# Altium schematic sheet ADR_LEDs.SchDoc
size A4; SheetNumber: 5; SheetTotal: 5
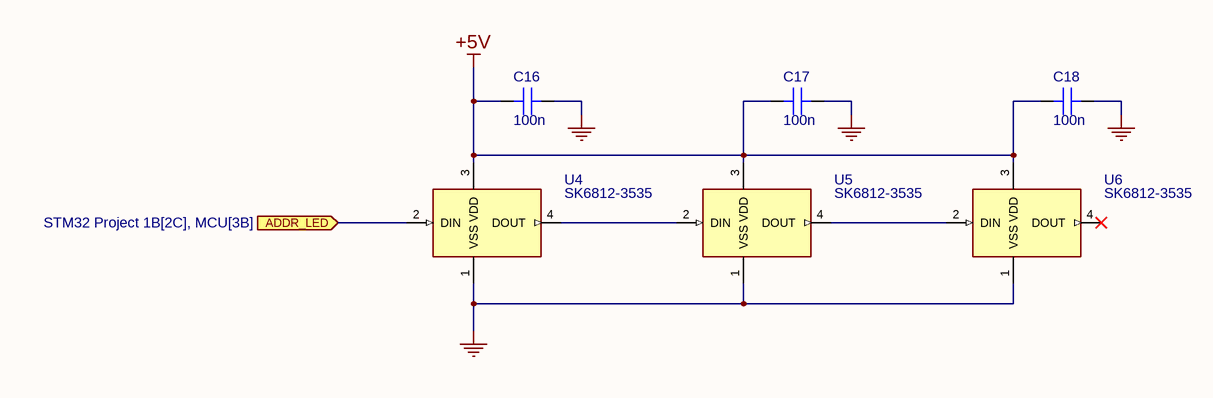
[diagram p0: ADR_LEDs.SchDoc]

## Parts
C16  100n  [CAP_0805]
C17  100n  [CAP_0805]
C18  100n  [CAP_0805]
U4  SK6812-3535  [SK6812-3535]
U5  SK6812-3535  [SK6812-3535]
U6  SK6812-3535  [SK6812-3535]

## Ports
ADDR_LED (in, see STM32 Project 1B[2C], MCU[3B])

## Nets
+5V: C16.2 C17.2 C18.2 U4.3(VDD) U5.3(VDD) U6.3(VDD)
GND: C16.1 C17.1 C18.1 U4.1(VSS) U5.1(VSS) U6.1(VSS)
ADDR_LED: U4.2(DIN) ; port ADDR_LED
NetU4_4: U4.4(DOUT) U5.2(DIN)
NetU5_4: U5.4(DOUT) U6.2(DIN)

Not connected (* = marked no-connect by the designer): U6 4(DOUT)*

## Library data of the parts
C16-C18 = CAP_0805: Capacitor SMD 0805 Generic; Manufacturer: *; Manufacturer Part Number: *; Tolerance: *; Voltage Rating: *; Dielectric: *
U4-U6 = SK6812-3535: NeoPixel 5050 RGB LED with Integrated Driver Chip - 10 Pack | Adafruit Industries 1655; Manufacturer Part Number: 1655; Number of LEDs: 10; Interface: Serial; Supplier: Digikey; Supplier Part Number: 1528-1104-ND; Manufacturer: Adafruit Industries; RoHS: Yes; Category: LEDs; Stock: 1730; Pricing: 1=4.5 (USD); Mounting Technology: Surface Mount; Color: Blue,Green,Red; Min Operating Temperature: -40°C; Max Operating Temperature: 85°C; Series: Neopixel; Length: 5mm; Width: 5mm; Height: 1.6mm; ComponentLink1URL: http://www.mouser.com/ds/2/737/SK6812_LED_datasheet_-953546.pdf?src-supplier=Mouser; ComponentLink1Description: http://www.mouser.com/ds/2/737/SK6812_LED_datasheet_-953546.pdf?src-supplier=Mouser; ComponentLink2URL: https://cdn-shop.adafruit.com/product-files/1138/SK6812+LED+datasheet+.pdf?src-supplier=Digikey; ComponentLink2Description: https://cdn-shop.adafruit.com/product-files/1138/SK6812+LED+datasheet+.pdf?src-supplier=Digikey